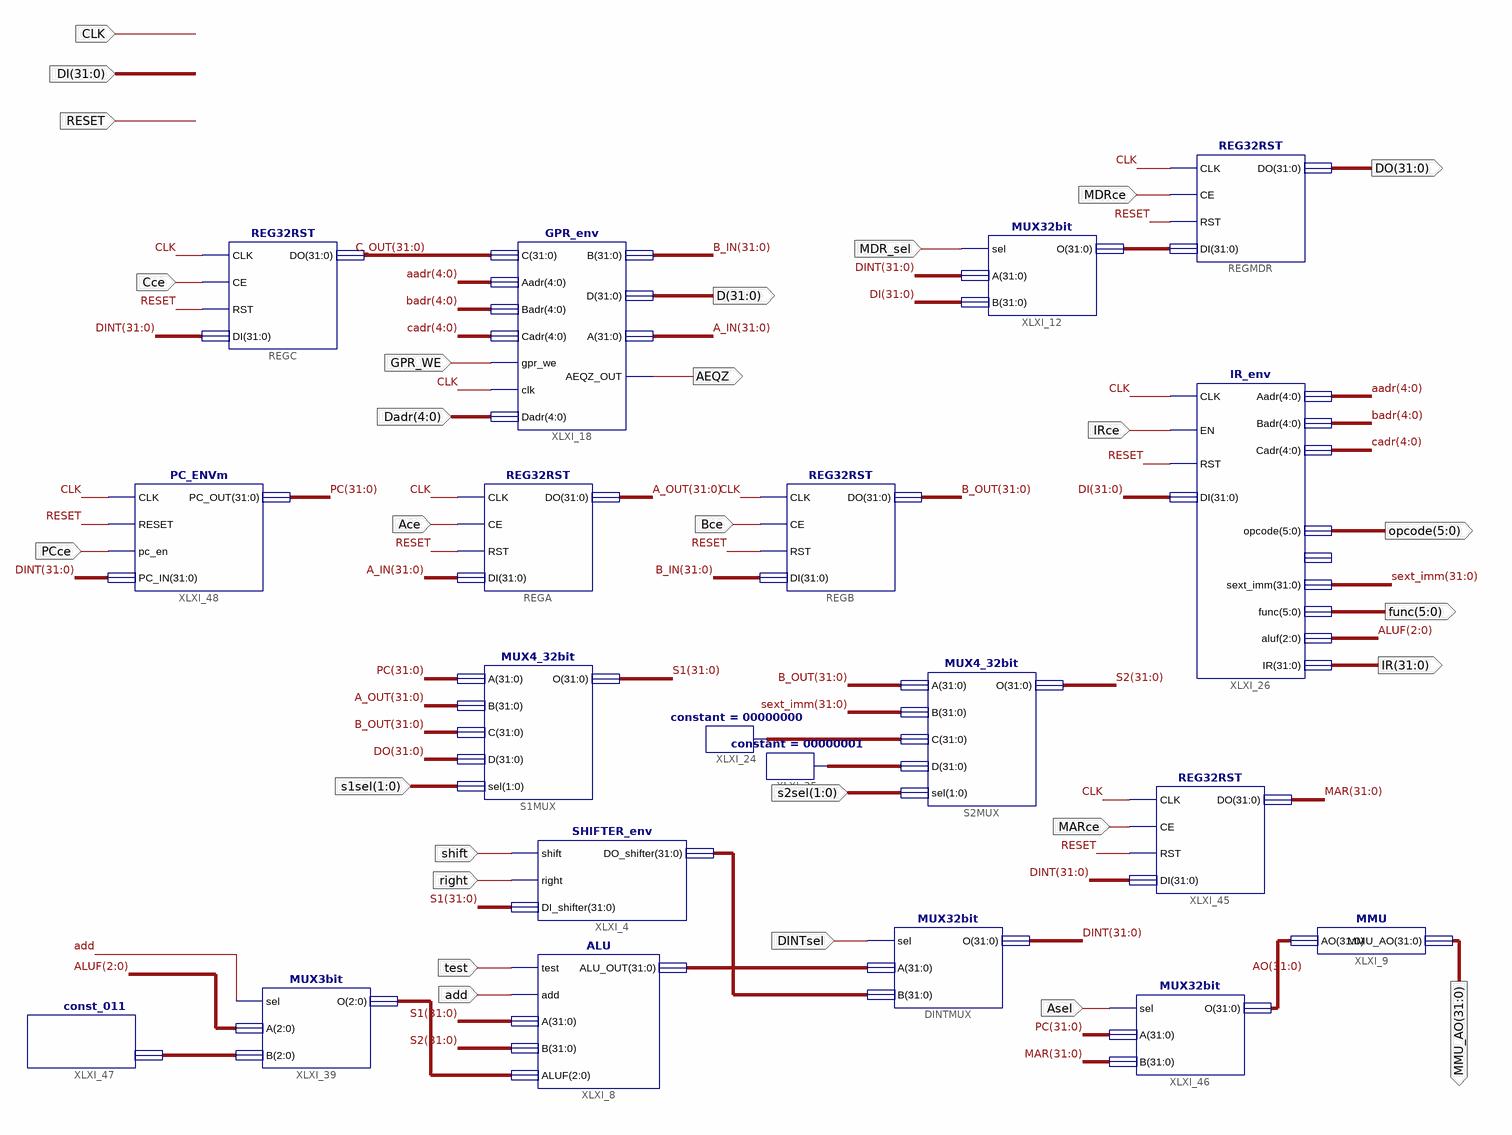
[diagram p0: schematic sheet 1]
// Xilinx ISE schematic FULL_DATAPATH.sch (spartan6) as structural Verilog: 20 symbols, 28 ports
module FULL_DATAPATH (
  input  CLK,
  input  [31:0] DI,
  input  MDR_sel,
  input  [1:0] s1sel,
  input  PCce,
  input  RESET,
  input  Ace,
  input  Bce,
  input  Cce,
  input  MDRce,
  input  GPR_WE,
  input  IRce,
  input  shift,
  input  right,
  input  test,
  input  add,
  input  [4:0] Dadr,
  input  DINTsel,
  input  [1:0] s2sel,
  input  MARce,
  input  Asel,
  output AEQZ,
  output [5:0] opcode,
  output [31:0] D,
  output [5:0] func,
  output [31:0] MMU_AO,
  output [31:0] DO,
  output [31:0] IR
);

  wire [2:0] ALUF, XLXN_134, XLXN_135;
  wire [4:0] aadr, badr, cadr;
  wire [31:0] A_IN, A_OUT, AO, B_IN, B_OUT, C_OUT, DINT, MAR, PC, S1, S2, sext_imm, XLXN_10, XLXN_15,
       XLXN_16, XLXN_131, XLXN_132;

  REG32RST REGA (.CLK(CLK), .CE(Ace), .RST(RESET), .DI(A_IN), .DO(A_OUT));
  REG32RST REGB (.CLK(CLK), .CE(Bce), .RST(RESET), .DI(B_IN), .DO(B_OUT));
  MMU XLXI_9 (.AO(AO), .MMU_AO(MMU_AO));
  MUX4_32bit S1MUX (.A(PC), .B(A_OUT), .C(B_OUT), .D(DO), .sel(s1sel), .O(S1));
  REG32RST REGMDR (.CLK(CLK), .CE(MDRce), .RST(RESET), .DI(XLXN_10), .DO(DO));
  MUX32bit XLXI_12 (.sel(MDR_sel), .A(DINT), .B(DI), .O(XLXN_10));
  GPR_env XLXI_18 (
    .C(C_OUT), .Aadr(aadr), .Badr(badr), .Cadr(cadr), .gpr_we(GPR_WE), .clk(CLK), .B(B_IN), .D(D), .A(A_IN),
    .AEQZ_OUT(AEQZ), .Dadr(Dadr));
  REG32RST REGC (.CLK(CLK), .CE(Cce), .RST(RESET), .DI(DINT), .DO(C_OUT));
  IR_env XLXI_26 (
    .CLK(CLK), .EN(IRce), .RST(RESET), .DI(DI), .Aadr(aadr), .Badr(badr), .Cadr(cadr), .sext_imm(sext_imm),
    .func(func), .aluf(ALUF), .IR(IR), .opcode(opcode));  // open: imm
  SHIFTER_env XLXI_4 (.shift(shift), .right(right), .DI_shifter(S1), .DO_shifter(XLXN_132));
  ALU XLXI_8 (.test(test), .add(add), .A(S1), .B(S2), .ALUF(XLXN_135), .ALU_OUT(XLXN_131));
  MUX3bit XLXI_39 (.sel(add), .A(ALUF), .B(XLXN_134), .O(XLXN_135));
  MUX32bit DINTMUX (.sel(DINTsel), .A(XLXN_131), .B(XLXN_132), .O(DINT));
  MUX4_32bit S2MUX (.A(B_OUT), .B(sext_imm), .C(XLXN_15), .D(XLXN_16), .sel(s2sel), .O(S2));
  constant #(.CValue("00000000")) XLXI_24 (.O(XLXN_15));
  constant #(.CValue("00000001")) XLXI_25 (.O(XLXN_16));
  REG32RST XLXI_45 (.CLK(CLK), .CE(MARce), .RST(RESET), .DI(DINT), .DO(MAR));
  MUX32bit XLXI_46 (.sel(Asel), .A(PC), .B(MAR), .O(AO));
  const_011 XLXI_47 (.out_const(XLXN_134));
  PC_ENVm XLXI_48 (.CLK(CLK), .RESET(RESET), .pc_en(PCce), .PC_IN(DINT), .PC_OUT(PC));
endmodule
